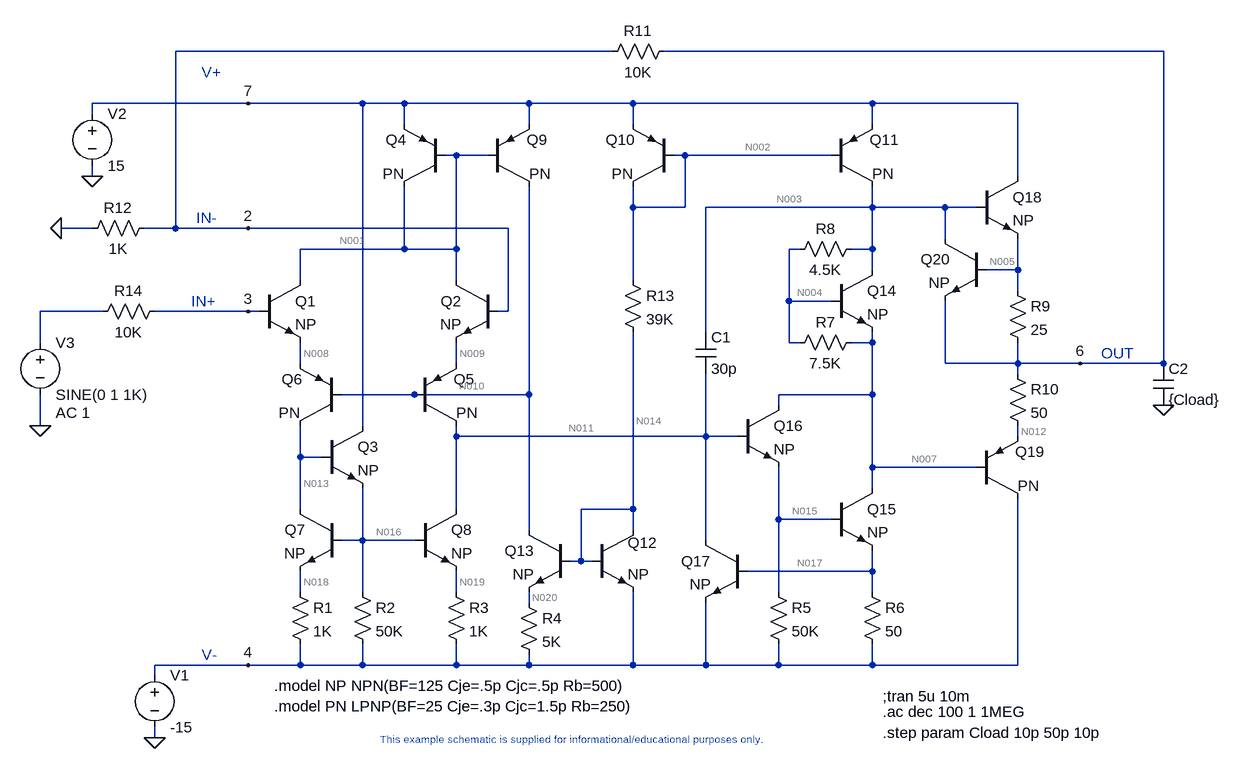
[diagram p0: schematic LM741_1d.asc]
LM741_1d.asc, the LTspice schematic file:
Version 4
SHEET 1 3772 1552
WIRE 2416 384 1744 384
WIRE 3264 384 2496 384
WIRE 1856 464 1616 464
WIRE 2032 464 1856 464
WIRE 2096 464 2032 464
WIRE 2288 464 2096 464
WIRE 2448 464 2288 464
WIRE 2816 464 2448 464
WIRE 3040 464 2816 464
WIRE 1616 480 1616 464
WIRE 2096 496 2096 464
WIRE 2288 496 2288 464
WIRE 2448 496 2448 464
WIRE 2816 496 2816 464
WIRE 2176 544 2160 544
WIRE 2224 544 2176 544
WIRE 2528 544 2512 544
WIRE 2752 544 2528 544
WIRE 1616 576 1616 560
WIRE 3040 576 3040 464
WIRE 2448 624 2448 592
WIRE 2528 624 2528 544
WIRE 2528 624 2448 624
WIRE 2816 624 2816 592
WIRE 2816 624 2560 624
WIRE 2928 624 2816 624
WIRE 2976 624 2928 624
WIRE 1616 656 1568 656
WIRE 1744 656 1744 384
WIRE 1744 656 1696 656
WIRE 1856 656 1744 656
WIRE 2256 656 1856 656
WIRE 2928 672 2928 624
WIRE 2096 688 2096 592
WIRE 2096 688 1936 688
WIRE 2176 688 2176 544
WIRE 2176 688 2096 688
WIRE 2704 688 2688 688
WIRE 2816 688 2816 624
WIRE 2816 688 2784 688
WIRE 2816 720 2816 688
WIRE 3040 720 3040 672
WIRE 3040 720 2992 720
WIRE 1936 736 1936 688
WIRE 2176 736 2176 688
WIRE 2448 736 2448 624
WIRE 3040 752 3040 720
WIRE 2688 768 2688 688
WIRE 2752 768 2688 768
WIRE 1632 784 1536 784
WIRE 1856 784 1712 784
WIRE 1872 784 1856 784
WIRE 2256 784 2256 656
WIRE 2256 784 2240 784
WIRE 2560 816 2560 624
WIRE 1536 832 1536 784
WIRE 2688 832 2688 768
WIRE 2704 832 2688 832
WIRE 2816 832 2816 816
WIRE 2816 832 2784 832
WIRE 1936 864 1936 832
WIRE 2176 864 2176 832
WIRE 2928 864 2928 768
WIRE 3040 864 3040 832
WIRE 3040 864 2928 864
WIRE 3136 864 3040 864
WIRE 3264 864 3264 384
WIRE 3264 864 3136 864
WIRE 3040 880 3040 864
WIRE 2112 912 2000 912
WIRE 2288 912 2288 592
WIRE 2288 912 2112 912
WIRE 2816 912 2816 832
WIRE 2816 912 2672 912
WIRE 2672 928 2672 912
WIRE 1536 960 1536 912
WIRE 2032 960 2032 464
WIRE 2176 976 2176 960
WIRE 2560 976 2560 880
WIRE 2560 976 2176 976
WIRE 2608 976 2560 976
WIRE 3040 976 3040 960
WIRE 1936 1008 1936 960
WIRE 1968 1008 1936 1008
WIRE 2816 1024 2816 912
WIRE 2976 1024 2816 1024
WIRE 2816 1056 2816 1024
WIRE 1936 1088 1936 1008
WIRE 2176 1088 2176 976
WIRE 2448 1088 2448 816
WIRE 2448 1088 2368 1088
WIRE 2672 1104 2672 1024
WIRE 2752 1104 2672 1104
WIRE 2288 1120 2288 912
WIRE 2448 1120 2448 1088
WIRE 2032 1136 2032 1056
WIRE 2032 1136 2000 1136
WIRE 2112 1136 2032 1136
WIRE 2560 1136 2560 976
WIRE 2368 1168 2368 1088
WIRE 2368 1168 2352 1168
WIRE 2384 1168 2368 1168
WIRE 2816 1184 2816 1152
WIRE 2816 1184 2624 1184
WIRE 1936 1216 1936 1184
WIRE 2032 1216 2032 1136
WIRE 2176 1216 2176 1184
WIRE 2672 1216 2672 1104
WIRE 2816 1216 2816 1184
WIRE 2288 1232 2288 1216
WIRE 1856 1328 1712 1328
WIRE 1936 1328 1936 1296
WIRE 1936 1328 1856 1328
WIRE 2032 1328 2032 1296
WIRE 2032 1328 1936 1328
WIRE 2176 1328 2176 1296
WIRE 2176 1328 2032 1328
WIRE 2288 1328 2288 1312
WIRE 2288 1328 2176 1328
WIRE 2448 1328 2448 1216
WIRE 2448 1328 2288 1328
WIRE 2560 1328 2560 1232
WIRE 2560 1328 2448 1328
WIRE 2672 1328 2672 1296
WIRE 2672 1328 2560 1328
WIRE 2816 1328 2816 1296
WIRE 2816 1328 2672 1328
WIRE 3040 1328 3040 1072
WIRE 3040 1328 2816 1328
WIRE 1712 1344 1712 1328
WIRE 1712 1440 1712 1424
FLAG 1856 784 3
FLAG 1856 656 2
FLAG 1712 1440 0
FLAG 3136 864 6
FLAG 1616 576 0
FLAG 1568 656 0
FLAG 1536 960 0
FLAG 1856 464 7
FLAG 1856 1328 4
FLAG 3264 928 0
SYMBOL NPN 1872 736 R0
SYMATTR InstName Q1
SYMATTR Value NP
SYMBOL npn 2240 736 M0
SYMATTR InstName Q2
SYMATTR Value NP
SYMBOL PNP 2112 960 M180
WINDOW 0 60 72 Left 2
WINDOW 3 64 20 Left 2
SYMATTR InstName Q5
SYMATTR Value PN
SYMBOL pnp 2000 960 R180
WINDOW 0 60 72 Left 2
WINDOW 3 64 20 Left 2
SYMATTR InstName Q6
SYMATTR Value PN
SYMBOL npn 2000 1088 M0
SYMATTR InstName Q7
SYMATTR Value NP
SYMBOL npn 2112 1088 R0
SYMATTR InstName Q8
SYMATTR Value NP
SYMBOL npn 1968 960 R0
SYMATTR InstName Q3
SYMATTR Value NP
SYMBOL pnp 2160 592 R180
WINDOW 0 60 72 Left 2
WINDOW 3 64 20 Left 2
SYMATTR InstName Q4
SYMATTR Value PN
SYMBOL RES 1920 1200 R0
SYMATTR InstName R1
SYMATTR Value 1K
SYMBOL res 2016 1200 R0
SYMATTR InstName R2
SYMATTR Value 50K
SYMBOL res 2160 1200 R0
SYMATTR InstName R3
SYMATTR Value 1K
SYMBOL pnp 2224 592 M180
WINDOW 0 60 72 Left 2
WINDOW 3 64 20 Left 2
SYMATTR InstName Q9
SYMATTR Value PN
SYMBOL pnp 2512 592 R180
WINDOW 0 60 72 Left 2
WINDOW 3 64 20 Left 2
SYMATTR InstName Q10
SYMATTR Value PN
SYMBOL pnp 2752 592 M180
WINDOW 0 60 72 Left 2
WINDOW 3 64 20 Left 2
SYMATTR InstName Q11
SYMATTR Value PN
SYMBOL npn 2384 1120 R0
WINDOW 0 56 20 Left 2
SYMATTR InstName Q12
SYMATTR Value NP
SYMBOL npn 2352 1120 M0
SYMATTR InstName Q13
SYMATTR Value NP
SYMBOL res 2272 1216 R0
SYMATTR InstName R4
SYMATTR Value 5K
SYMBOL npn 2752 720 R0
SYMATTR InstName Q14
SYMATTR Value NP
SYMBOL npn 2752 1056 R0
SYMATTR InstName Q15
SYMATTR Value NP
SYMBOL npn 2608 928 R0
SYMATTR InstName Q16
SYMATTR Value NP
SYMBOL res 2656 1200 R0
SYMATTR InstName R5
SYMATTR Value 50K
SYMBOL res 2800 1200 R0
SYMATTR InstName R6
SYMATTR Value 50
SYMBOL npn 2624 1136 M0
SYMATTR InstName Q17
SYMATTR Value NP
SYMBOL cap 2544 816 R0
SYMATTR InstName C1
SYMATTR Value 30p
SYMBOL res 2800 816 R90
WINDOW 0 0 56 VBottom 2
WINDOW 3 32 56 VTop 2
SYMATTR InstName R7
SYMATTR Value 7.5K
SYMBOL res 2800 672 R90
WINDOW 0 0 56 VBottom 2
WINDOW 3 32 56 VTop 2
SYMATTR InstName R8
SYMATTR Value 4.5K
SYMBOL npn 2976 576 R0
SYMATTR InstName Q18
SYMATTR Value NP
SYMBOL pnp 2976 1072 M180
WINDOW 0 60 72 Left 2
WINDOW 3 64 20 Left 2
SYMATTR InstName Q19
SYMATTR Value PN
SYMBOL res 3024 736 R0
SYMATTR InstName R9
SYMATTR Value 25
SYMBOL res 3024 864 R0
SYMATTR InstName R10
SYMATTR Value 50
SYMBOL npn 2992 672 M0
SYMATTR InstName Q20
SYMATTR Value NP
SYMBOL VOLTAGE 1712 1328 R0
SYMATTR InstName V1
SYMATTR Value -15
SYMBOL voltage 1616 464 R0
SYMATTR InstName V2
SYMATTR Value 15
SYMBOL res 2512 368 R90
WINDOW 0 0 56 VBottom 2
WINDOW 3 32 56 VTop 2
SYMATTR InstName R11
SYMATTR Value 10K
SYMBOL res 1712 640 R90
WINDOW 0 0 56 VBottom 2
WINDOW 3 32 56 VTop 2
SYMATTR InstName R12
SYMATTR Value 1K
SYMBOL voltage 1536 816 R0
WINDOW 123 24 124 Left 2
WINDOW 39 0 0 Left 2
SYMATTR Value2 AC 1
SYMATTR InstName V3
SYMATTR Value SINE(0 1 1K)
SYMBOL res 2432 720 R0
SYMATTR InstName R13
SYMATTR Value 39K
SYMBOL res 1728 768 R90
WINDOW 0 0 56 VBottom 2
WINDOW 3 32 56 VTop 2
SYMATTR InstName R14
SYMATTR Value 10K
SYMBOL cap 3248 864 R0
SYMATTR InstName C2
SYMATTR Value {Cload}
TEXT 1768 768 Left 2 ;IN+
TEXT 1776 640 Left 2 ;IN-
TEXT 3168 848 Left 2 ;OUT
TEXT 2832 1376 Left 2 !;tran 5u 10m
TEXT 2344 1432 Top 1 ;This example schematic is supplied for informational/educational purposes only.
TEXT 1784 1312 Left 2 ;V-
TEXT 1784 416 Left 2 ;V+
TEXT 1896 1360 Left 2 !.model NP NPN(BF=125 Cje=.5p Cjc=.5p Rb=500)\n.model PN LPNP(BF=25 Cje=.3p Cjc=1.5p Rb=250)
TEXT 2832 1400 Left 2 !.ac dec 100 1 1MEG
TEXT 2832 1432 Left 2 !.step param Cload 10p 50p 10p

The netlist it stands for:
* LM741_1d.asc
Q1 N001 3 N008 0 NP
Q2 N001 2 N009 0 NP
Q5 N011 N010 N009 0 PN
Q6 N013 N010 N008 0 PN
Q7 N013 N016 N018 0 NP
Q8 N011 N016 N019 0 NP
Q3 7 N013 N016 0 NP
Q4 N001 N001 7 0 PN
R1 N018 4 1K
R2 N016 4 50K
R3 N019 4 1K
Q9 N010 N001 7 0 PN
Q10 N002 N002 7 0 PN
Q11 N003 N002 7 0 PN
Q12 N014 N014 4 0 NP
Q13 N010 N014 N020 0 NP
R4 N020 4 5K
Q14 N003 N004 N007 0 NP
Q15 N007 N015 N017 0 NP
Q16 N007 N011 N015 0 NP
R5 N015 4 50K
R6 N017 4 50
Q17 N011 N017 4 0 NP
C1 N003 N011 30p
R7 N007 N004 7.5K
R8 N003 N004 4.5K
Q18 7 N003 N005 0 NP
Q19 4 N007 N012 0 PN
R9 N005 6 25
R10 6 N012 50
Q20 N003 N005 6 0 NP
V1 4 0 -15
V2 7 0 15
R11 6 2 10K
R12 2 0 1K
V3 N006 0 SINE(0 1 1K) AC 1
R13 N002 N014 39K
R14 3 N006 10K
C2 6 0 {Cload}
.model NPN NPN
.model PNP PNP
.lib standard.bjt
* IN+
* IN-
* OUT
;tran 5u 10m
* This example schematic is supplied for informational/educational purposes only.
* V-
* V+
.model NP NPN(BF=125 Cje=.5p Cjc=.5p Rb=500)
.model PN LPNP(BF=25 Cje=.3p Cjc=1.5p Rb=250)
.ac dec 100 1 1MEG
.step param Cload 10p 50p 10p
.backanno
.end

* Results of the author's LTspice run, read from the files saved beside the schematic
* Operating Point (first step), zero values left out:
*   cload = 10 p
*   V(n001) = 14.33 V
*   V(3) = -793 µV
*   V(n008) = -655.7 mV
*   V(2) = -460 µV
*   V(n009) = -655.6 mV
*   V(n011) = -13.53 V
*   V(n010) = -1.31 V
*   V(n013) = -13.67 V
*   V(n016) = -14.34 V
*   V(n018) = -14.99 V
*   V(n019) = -14.99 V
*   V(7) = 15 V
*   V(4) = -15 V
*   V(n002) = 14.23 V
*   V(n003) = 614 mV
*   V(n014) = -14.23 V
*   V(n020) = -14.9 V
*   V(n004) = 136.3 mV
*   V(n007) = -625.6 mV
*   V(n015) = -14.2 V
*   V(n017) = -14.97 V
*   V(n005) = -4.201 mV
*   V(n012) = -4.402 mV
*   V(6) = -4.262 mV
*   Ic(Q19) = -2.692 µA
*   Ib(Q19) = -107.7 nA
*   Ie(Q19) = 2.8 µA
*   Ic(Q11) = -675.7 µA
*   Ib(Q11) = -27.03 µA
*   Ie(Q11) = 702.7 µA
*   Ic(Q10) = -675.7 µA
*   Ib(Q10) = -27.03 µA
*   Ie(Q10) = 702.7 µA
*   Ic(Q9) = -18.42 µA
*   Ib(Q9) = -736.7 nA
*   Ie(Q9) = 19.15 µA
*   Ic(Q4) = -18.42 µA
*   Ib(Q4) = -736.7 nA
*   Ie(Q4) = 19.15 µA
*   Ic(Q6) = -9.609 µA
*   Ib(Q6) = -384.3 nA
*   Ie(Q6) = 9.993 µA
*   Ic(Q5) = -9.671 µA
*   Ib(Q5) = -386.8 nA
*   Ie(Q5) = 10.06 µA
*   Ic(Q18) = 2.4 µA
*   Ib(Q18) = 19.19 nA
*   Ie(Q18) = -2.419 µA
*   Ic(Q17) = 1.441 pA
*   Ib(Q17) = -1.407 pA
*   Ic(Q16) = 21.05 µA
*   Ib(Q16) = 168.4 nA
*   Ie(Q16) = -21.22 µA
*   Ic(Q15) = 654.7 µA
*   Ib(Q15) = 5.238 µA
*   Ie(Q15) = -660 µA
*   Ic(Q14) = 569.5 µA
*   Ib(Q14) = 4.556 µA
*   Ie(Q14) = -574.1 µA
*   Ic(Q13) = 19.19 µA
*   Ib(Q13) = 153.5 nA
*   Ie(Q13) = -19.34 µA
*   Ic(Q12) = 723.8 µA
*   Ib(Q12) = 5.79 µA
*   Ie(Q12) = -729.6 µA
*   Ic(Q3) = 13.31 µA
*   Ib(Q3) = 106.5 nA
*   Ie(Q3) = -13.42 µA
*   Ic(Q8) = 9.502 µA
*   Ib(Q8) = 76.02 nA
*   Ie(Q8) = -9.578 µA
*   Ic(Q7) = 9.502 µA
*   Ib(Q7) = 76.02 nA
*   Ie(Q7) = -9.578 µA
*   Ic(Q2) = 9.978 µA
*   Ib(Q2) = 79.81 nA
*   Ie(Q2) = -10.06 µA
*   Ic(Q1) = 9.914 µA
*   Ib(Q1) = 79.3 nA
*   Ie(Q1) = -9.993 µA
*   I(R14) = -79.3 nA
*   I(R13) = 729.8 µA
*   I(R12) = -460 nA
*   I(R11) = -380.2 nA
*   I(R10) = 2.8 µA
*   I(R9) = 2.419 µA
*   I(R8) = 106.1 µA
*   I(R7) = -101.6 µA
*   I(R6) = 660 µA
*   I(R5) = 15.98 µA
*   I(R4) = 19.34 µA
*   I(R3) = 9.578 µA
*   I(R2) = 13.27 µA
*   I(R1) = 9.578 µA
*   I(V3) = -79.3 nA
*   I(V2) = -1.459 mA
*   I(V1) = 1.46 mA